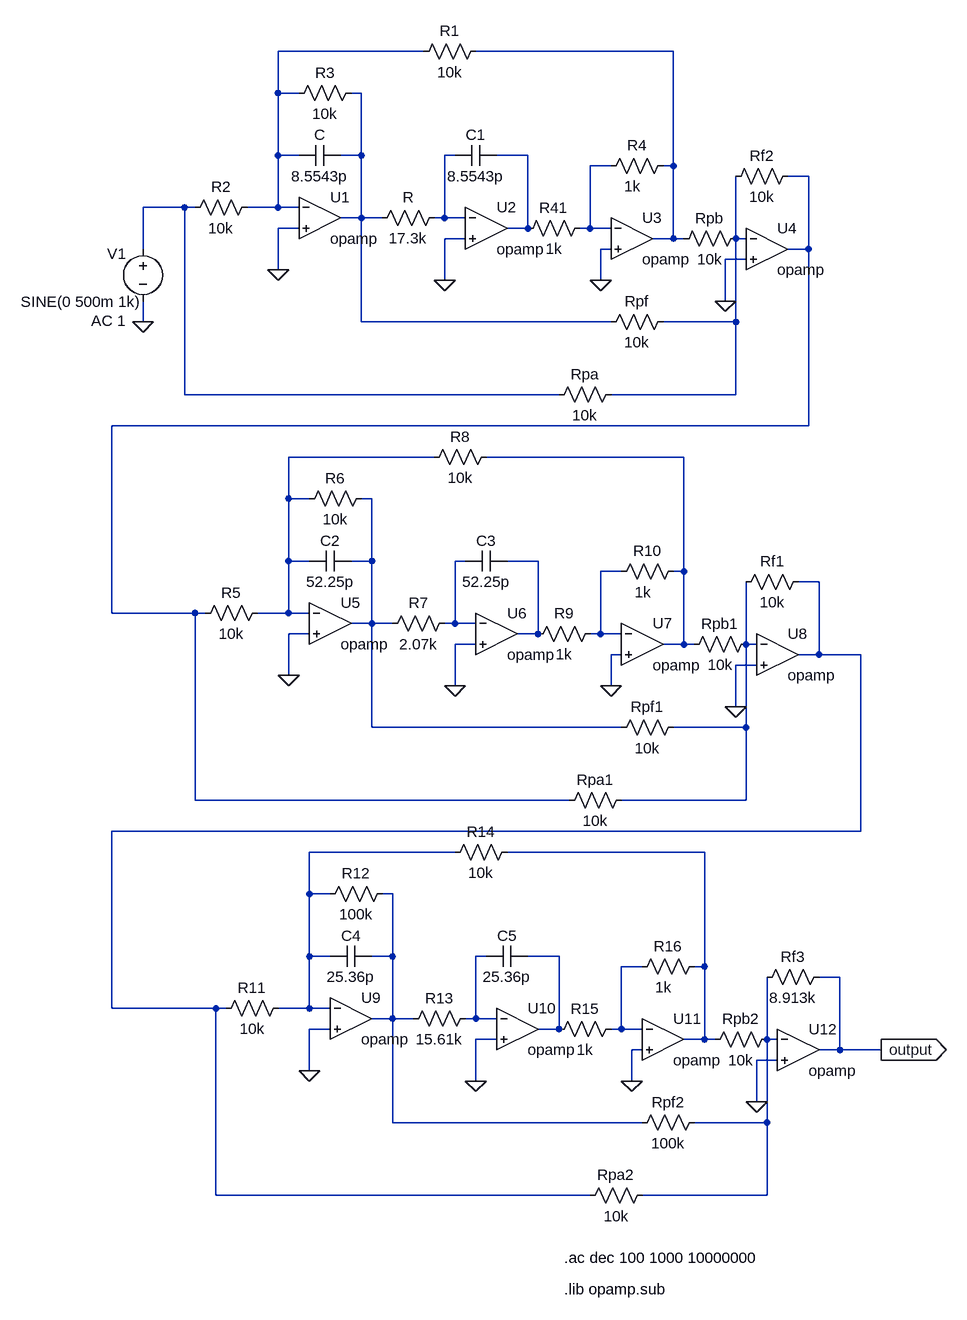
[diagram p0: schematic simulacao_filtro.asc]
simulacao_filtro.asc, the LTspice schematic file:
Version 4
SHEET 1 3368 1256
WIRE 1072 -816 848 -816
WIRE 1456 -816 1152 -816
WIRE 848 -752 848 -816
WIRE 880 -752 848 -752
WIRE 976 -752 960 -752
WIRE 848 -656 848 -752
WIRE 880 -656 848 -656
WIRE 976 -656 976 -752
WIRE 976 -656 944 -656
WIRE 1120 -656 1104 -656
WIRE 1232 -656 1184 -656
WIRE 1360 -640 1328 -640
WIRE 1456 -640 1456 -816
WIRE 1456 -640 1440 -640
WIRE 1664 -624 1632 -624
WIRE 704 -576 640 -576
WIRE 720 -576 704 -576
WIRE 848 -576 848 -656
WIRE 848 -576 800 -576
WIRE 880 -576 848 -576
WIRE 976 -560 976 -656
WIRE 976 -560 944 -560
WIRE 1008 -560 976 -560
WIRE 1104 -560 1104 -656
WIRE 1104 -560 1088 -560
WIRE 1136 -560 1104 -560
WIRE 880 -544 848 -544
WIRE 1232 -544 1232 -656
WIRE 1232 -544 1200 -544
WIRE 1328 -544 1328 -640
WIRE 1328 -544 1312 -544
WIRE 1360 -544 1328 -544
WIRE 1136 -528 1104 -528
WIRE 1456 -528 1456 -640
WIRE 1456 -528 1424 -528
WIRE 1472 -528 1456 -528
WIRE 1552 -528 1552 -624
WIRE 1568 -528 1552 -528
WIRE 640 -512 640 -576
WIRE 1360 -512 1344 -512
WIRE 1664 -512 1664 -624
WIRE 1664 -512 1632 -512
WIRE 1568 -496 1536 -496
WIRE 848 -480 848 -544
WIRE 1104 -464 1104 -528
WIRE 1344 -464 1344 -512
WIRE 1536 -432 1536 -496
WIRE 640 -400 640 -432
WIRE 976 -400 976 -560
WIRE 1360 -400 976 -400
WIRE 1552 -400 1552 -528
WIRE 1552 -400 1440 -400
WIRE 704 -288 704 -576
WIRE 1280 -288 704 -288
WIRE 1552 -288 1552 -400
WIRE 1552 -288 1360 -288
WIRE 1664 -240 1664 -512
WIRE 1664 -240 592 -240
WIRE 1088 -192 864 -192
WIRE 1472 -192 1168 -192
WIRE 864 -128 864 -192
WIRE 896 -128 864 -128
WIRE 992 -128 976 -128
WIRE 864 -32 864 -128
WIRE 896 -32 864 -32
WIRE 992 -32 992 -128
WIRE 992 -32 960 -32
WIRE 1136 -32 1120 -32
WIRE 1248 -32 1200 -32
WIRE 1376 -16 1344 -16
WIRE 1472 -16 1472 -192
WIRE 1472 -16 1456 -16
WIRE 1680 0 1648 0
WIRE 592 48 592 -240
WIRE 720 48 592 48
WIRE 736 48 720 48
WIRE 864 48 864 -32
WIRE 864 48 816 48
WIRE 896 48 864 48
WIRE 992 64 992 -32
WIRE 992 64 960 64
WIRE 1024 64 992 64
WIRE 1120 64 1120 -32
WIRE 1120 64 1104 64
WIRE 1152 64 1120 64
WIRE 896 80 864 80
WIRE 1248 80 1248 -32
WIRE 1248 80 1216 80
WIRE 1344 80 1344 -16
WIRE 1344 80 1328 80
WIRE 1376 80 1344 80
WIRE 1152 96 1120 96
WIRE 1472 96 1472 -16
WIRE 1472 96 1440 96
WIRE 1488 96 1472 96
WIRE 1568 96 1568 0
WIRE 1584 96 1568 96
WIRE 1376 112 1360 112
WIRE 1680 112 1680 0
WIRE 1680 112 1648 112
WIRE 1744 112 1680 112
WIRE 1584 128 1552 128
WIRE 864 144 864 80
WIRE 1120 160 1120 96
WIRE 1360 160 1360 112
WIRE 1552 192 1552 128
WIRE 992 224 992 64
WIRE 1376 224 992 224
WIRE 1568 224 1568 96
WIRE 1568 224 1456 224
WIRE 720 336 720 48
WIRE 1296 336 720 336
WIRE 1568 336 1568 224
WIRE 1568 336 1376 336
WIRE 1744 384 1744 112
WIRE 1744 384 592 384
WIRE 1120 416 896 416
WIRE 1504 416 1200 416
WIRE 896 480 896 416
WIRE 928 480 896 480
WIRE 1024 480 1008 480
WIRE 896 576 896 480
WIRE 928 576 896 576
WIRE 1024 576 1024 480
WIRE 1024 576 992 576
WIRE 1168 576 1152 576
WIRE 1280 576 1232 576
WIRE 1408 592 1376 592
WIRE 1504 592 1504 416
WIRE 1504 592 1488 592
WIRE 1712 608 1680 608
WIRE 592 656 592 384
WIRE 752 656 592 656
WIRE 768 656 752 656
WIRE 896 656 896 576
WIRE 896 656 848 656
WIRE 928 656 896 656
WIRE 1024 672 1024 576
WIRE 1024 672 992 672
WIRE 1056 672 1024 672
WIRE 1152 672 1152 576
WIRE 1152 672 1136 672
WIRE 1184 672 1152 672
WIRE 928 688 896 688
WIRE 1280 688 1280 576
WIRE 1280 688 1248 688
WIRE 1376 688 1376 592
WIRE 1376 688 1360 688
WIRE 1408 688 1376 688
WIRE 1184 704 1152 704
WIRE 1504 704 1504 592
WIRE 1504 704 1472 704
WIRE 1520 704 1504 704
WIRE 1600 704 1600 608
WIRE 1616 704 1600 704
WIRE 1408 720 1392 720
WIRE 1712 720 1712 608
WIRE 1712 720 1680 720
WIRE 1776 720 1712 720
WIRE 1616 736 1584 736
WIRE 896 752 896 688
WIRE 1152 768 1152 704
WIRE 1392 768 1392 720
WIRE 1584 800 1584 736
WIRE 1024 832 1024 672
WIRE 1408 832 1024 832
WIRE 1600 832 1600 704
WIRE 1600 832 1488 832
WIRE 752 944 752 656
WIRE 1328 944 752 944
WIRE 1600 944 1600 832
WIRE 1600 944 1408 944
FLAG 848 -480 0
FLAG 1104 -464 0
FLAG 1344 -464 0
FLAG 1536 -432 0
FLAG 640 -400 0
FLAG 864 144 0
FLAG 1120 160 0
FLAG 1360 160 0
FLAG 1552 192 0
FLAG 896 752 0
FLAG 1152 768 0
FLAG 1392 768 0
FLAG 1584 800 0
FLAG 1776 720 output
IOPIN 1776 720 Out
SYMBOL OpAmps\\opamp 912 -624 R0
SYMATTR InstName U1
SYMATTR SpiceLine2 GBW=100G
SYMBOL OpAmps\\opamp 1168 -608 R0
SYMATTR InstName U2
SYMATTR SpiceLine2 GBW=100G
SYMBOL OpAmps\\opamp 1392 -592 R0
SYMATTR InstName U3
SYMATTR SpiceLine2 GBW=100G
SYMBOL OpAmps\\opamp 1600 -576 R0
SYMATTR InstName U4
SYMATTR SpiceLine2 GBW=100G
SYMBOL res 816 -592 R90
WINDOW 0 0 56 VBottom 2
WINDOW 3 32 56 VTop 2
SYMATTR InstName R2
SYMATTR Value 10k
SYMBOL res 976 -768 R90
WINDOW 0 0 56 VBottom 2
WINDOW 3 32 56 VTop 2
SYMATTR InstName R3
SYMATTR Value 10k
SYMBOL res 1104 -576 R90
WINDOW 0 0 56 VBottom 2
WINDOW 3 32 56 VTop 2
SYMATTR InstName R
SYMATTR Value 17.3k
SYMBOL res 1168 -832 R90
WINDOW 0 0 56 VBottom 2
WINDOW 3 32 56 VTop 2
SYMATTR InstName R1
SYMATTR Value 10k
SYMBOL res 1328 -560 R90
WINDOW 0 0 56 VBottom 2
WINDOW 3 32 56 VTop 2
SYMATTR InstName R41
SYMATTR Value 1k
SYMBOL res 1456 -656 R90
WINDOW 0 0 56 VBottom 2
WINDOW 3 32 63 VTop 2
SYMATTR InstName R4
SYMATTR Value 1k
SYMBOL res 1568 -544 R90
WINDOW 0 0 56 VBottom 2
WINDOW 3 32 56 VTop 2
SYMATTR InstName Rpb
SYMATTR Value 10k
SYMBOL res 1648 -640 R90
WINDOW 0 0 56 VBottom 2
WINDOW 3 32 56 VTop 2
SYMATTR InstName Rf2
SYMATTR Value 10k
SYMBOL res 1456 -416 R90
WINDOW 0 0 56 VBottom 2
WINDOW 3 32 56 VTop 2
SYMATTR InstName Rpf
SYMATTR Value 10k
SYMBOL res 1376 -304 R90
WINDOW 0 0 56 VBottom 2
WINDOW 3 32 56 VTop 2
SYMATTR InstName Rpa
SYMATTR Value 10k
SYMBOL cap 944 -672 R90
WINDOW 0 0 32 VBottom 2
WINDOW 3 32 32 VTop 2
SYMATTR InstName C
SYMATTR Value 8.5543p
SYMBOL cap 1184 -672 R90
WINDOW 0 0 32 VBottom 2
WINDOW 3 32 32 VTop 2
SYMATTR InstName C1
SYMATTR Value 8.5543p
SYMBOL voltage 640 -528 R0
WINDOW 123 -80 126 Left 2
WINDOW 39 0 0 Left 0
WINDOW 0 -55 23 Left 2
WINDOW 3 -188 97 Left 2
SYMATTR Value2 AC 1
SYMATTR InstName V1
SYMATTR Value SINE(0 500m 1k)
SYMBOL OpAmps\\opamp 928 0 R0
SYMATTR InstName U5
SYMATTR SpiceLine2 GBW=100G
SYMBOL OpAmps\\opamp 1184 16 R0
SYMATTR InstName U6
SYMATTR SpiceLine2 GBW=100G
SYMBOL OpAmps\\opamp 1408 32 R0
SYMATTR InstName U7
SYMATTR SpiceLine2 GBW=100G
SYMBOL OpAmps\\opamp 1616 48 R0
SYMATTR InstName U8
SYMATTR SpiceLine2 GBW=100G
SYMBOL res 832 32 R90
WINDOW 0 0 56 VBottom 2
WINDOW 3 32 56 VTop 2
SYMATTR InstName R5
SYMATTR Value 10k
SYMBOL res 992 -144 R90
WINDOW 0 0 56 VBottom 2
WINDOW 3 32 56 VTop 2
SYMATTR InstName R6
SYMATTR Value 10k
SYMBOL res 1120 48 R90
WINDOW 0 0 56 VBottom 2
WINDOW 3 32 56 VTop 2
SYMATTR InstName R7
SYMATTR Value 2.07k
SYMBOL res 1184 -208 R90
WINDOW 0 0 56 VBottom 2
WINDOW 3 32 56 VTop 2
SYMATTR InstName R8
SYMATTR Value 10k
SYMBOL res 1344 64 R90
WINDOW 0 0 56 VBottom 2
WINDOW 3 32 56 VTop 2
SYMATTR InstName R9
SYMATTR Value 1k
SYMBOL res 1472 -32 R90
WINDOW 0 0 56 VBottom 2
WINDOW 3 32 63 VTop 2
SYMATTR InstName R10
SYMATTR Value 1k
SYMBOL res 1584 80 R90
WINDOW 0 0 56 VBottom 2
WINDOW 3 32 56 VTop 2
SYMATTR InstName Rpb1
SYMATTR Value 10k
SYMBOL res 1664 -16 R90
WINDOW 0 0 56 VBottom 2
WINDOW 3 32 56 VTop 2
SYMATTR InstName Rf1
SYMATTR Value 10k
SYMBOL res 1472 208 R90
WINDOW 0 0 56 VBottom 2
WINDOW 3 32 56 VTop 2
SYMATTR InstName Rpf1
SYMATTR Value 10k
SYMBOL res 1392 320 R90
WINDOW 0 0 56 VBottom 2
WINDOW 3 32 56 VTop 2
SYMATTR InstName Rpa1
SYMATTR Value 10k
SYMBOL cap 960 -48 R90
WINDOW 0 0 32 VBottom 2
WINDOW 3 32 32 VTop 2
SYMATTR InstName C2
SYMATTR Value 52.25p
SYMBOL cap 1200 -48 R90
WINDOW 0 0 32 VBottom 2
WINDOW 3 32 32 VTop 2
SYMATTR InstName C3
SYMATTR Value 52.25p
SYMBOL OpAmps\\opamp 960 608 R0
SYMATTR InstName U9
SYMATTR SpiceLine2 GBW=100G
SYMBOL OpAmps\\opamp 1216 624 R0
SYMATTR InstName U10
SYMATTR SpiceLine2 GBW=100G
SYMBOL OpAmps\\opamp 1440 640 R0
SYMATTR InstName U11
SYMATTR SpiceLine2 GBW=100G
SYMBOL OpAmps\\opamp 1648 656 R0
SYMATTR InstName U12
SYMATTR SpiceLine2 GBW=100G
SYMBOL res 864 640 R90
WINDOW 0 0 56 VBottom 2
WINDOW 3 32 56 VTop 2
SYMATTR InstName R11
SYMATTR Value 10k
SYMBOL res 1024 464 R90
WINDOW 0 0 56 VBottom 2
WINDOW 3 32 56 VTop 2
SYMATTR InstName R12
SYMATTR Value 100k
SYMBOL res 1152 656 R90
WINDOW 0 0 56 VBottom 2
WINDOW 3 32 56 VTop 2
SYMATTR InstName R13
SYMATTR Value 15.61k
SYMBOL res 1216 400 R90
WINDOW 0 0 56 VBottom 2
WINDOW 3 32 56 VTop 2
SYMATTR InstName R14
SYMATTR Value 10k
SYMBOL res 1376 672 R90
WINDOW 0 0 56 VBottom 2
WINDOW 3 32 56 VTop 2
SYMATTR InstName R15
SYMATTR Value 1k
SYMBOL res 1504 576 R90
WINDOW 0 0 56 VBottom 2
WINDOW 3 32 63 VTop 2
SYMATTR InstName R16
SYMATTR Value 1k
SYMBOL res 1616 688 R90
WINDOW 0 0 56 VBottom 2
WINDOW 3 32 56 VTop 2
SYMATTR InstName Rpb2
SYMATTR Value 10k
SYMBOL res 1696 592 R90
WINDOW 0 0 56 VBottom 2
WINDOW 3 32 56 VTop 2
SYMATTR InstName Rf3
SYMATTR Value 8.913k
SYMBOL res 1504 816 R90
WINDOW 0 0 56 VBottom 2
WINDOW 3 32 56 VTop 2
SYMATTR InstName Rpf2
SYMATTR Value 100k
SYMBOL res 1424 928 R90
WINDOW 0 0 56 VBottom 2
WINDOW 3 32 56 VTop 2
SYMATTR InstName Rpa2
SYMATTR Value 10k
SYMBOL cap 992 560 R90
WINDOW 0 0 32 VBottom 2
WINDOW 3 32 32 VTop 2
SYMATTR InstName C4
SYMATTR Value 25.36p
SYMBOL cap 1232 560 R90
WINDOW 0 0 32 VBottom 2
WINDOW 3 32 32 VTop 2
SYMATTR InstName C5
SYMATTR Value 25.36p
TEXT 1288 1040 Left 2 !.ac dec 100 1000 10000000
TEXT 1288 1088 Left 2 !.lib opamp.sub

The netlist it stands for:
* simulacao_filtro.asc
XU1 N001 0 N003 opamp Aol=100K GBW=100G  ; pins invin noninvin out
XU2 N004 0 N005 opamp Aol=100K GBW=100G  ; pins invin noninvin out
XU3 N006 0 N002 opamp Aol=100K GBW=100G  ; pins invin noninvin out
XU4 N009 0 N007 opamp Aol=100K GBW=100G  ; pins invin noninvin out
R2 N001 N008 10k
R3 N003 N001 10k
R N004 N003 17.3k
R1 N002 N001 10k
R41 N006 N005 1k
R4 N002 N006 1k
Rpb N009 N002 10k
Rf2 N007 N009 10k
Rpf N009 N003 10k
Rpa N009 N008 10k
C N003 N001 8.5543p
C1 N005 N004 8.5543p
V1 N008 0 SINE(0 500m 1k) AC 1
XU5 N010 0 N012 opamp Aol=100K GBW=100G  ; pins invin noninvin out
XU6 N013 0 N014 opamp Aol=100K GBW=100G  ; pins invin noninvin out
XU7 N015 0 N011 opamp Aol=100K GBW=100G  ; pins invin noninvin out
XU8 N017 0 N016 opamp Aol=100K GBW=100G  ; pins invin noninvin out
R5 N010 N007 10k
R6 N012 N010 10k
R7 N013 N012 2.07k
R8 N011 N010 10k
R9 N015 N014 1k
R10 N011 N015 1k
Rpb1 N017 N011 10k
Rf1 N016 N017 10k
Rpf1 N017 N012 10k
Rpa1 N017 N007 10k
C2 N012 N010 52.25p
C3 N014 N013 52.25p
XU9 N018 0 N020 opamp Aol=100K GBW=100G  ; pins invin noninvin out
XU10 N021 0 N022 opamp Aol=100K GBW=100G  ; pins invin noninvin out
XU11 N023 0 N019 opamp Aol=100K GBW=100G  ; pins invin noninvin out
XU12 N024 0 output opamp Aol=100K GBW=100G  ; pins invin noninvin out
R11 N018 N016 10k
R12 N020 N018 100k
R13 N021 N020 15.61k
R14 N019 N018 10k
R15 N023 N022 1k
R16 N019 N023 1k
Rpb2 N024 N019 10k
Rf3 output N024 8.913k
Rpf2 N024 N020 100k
Rpa2 N024 N016 10k
C4 N020 N018 25.36p
C5 N022 N021 25.36p
.ac dec 100 1000 10000000
.lib opamp.sub
.backanno
.end